# EAGLE schematic LEDs (EAGLE 9.5.2)
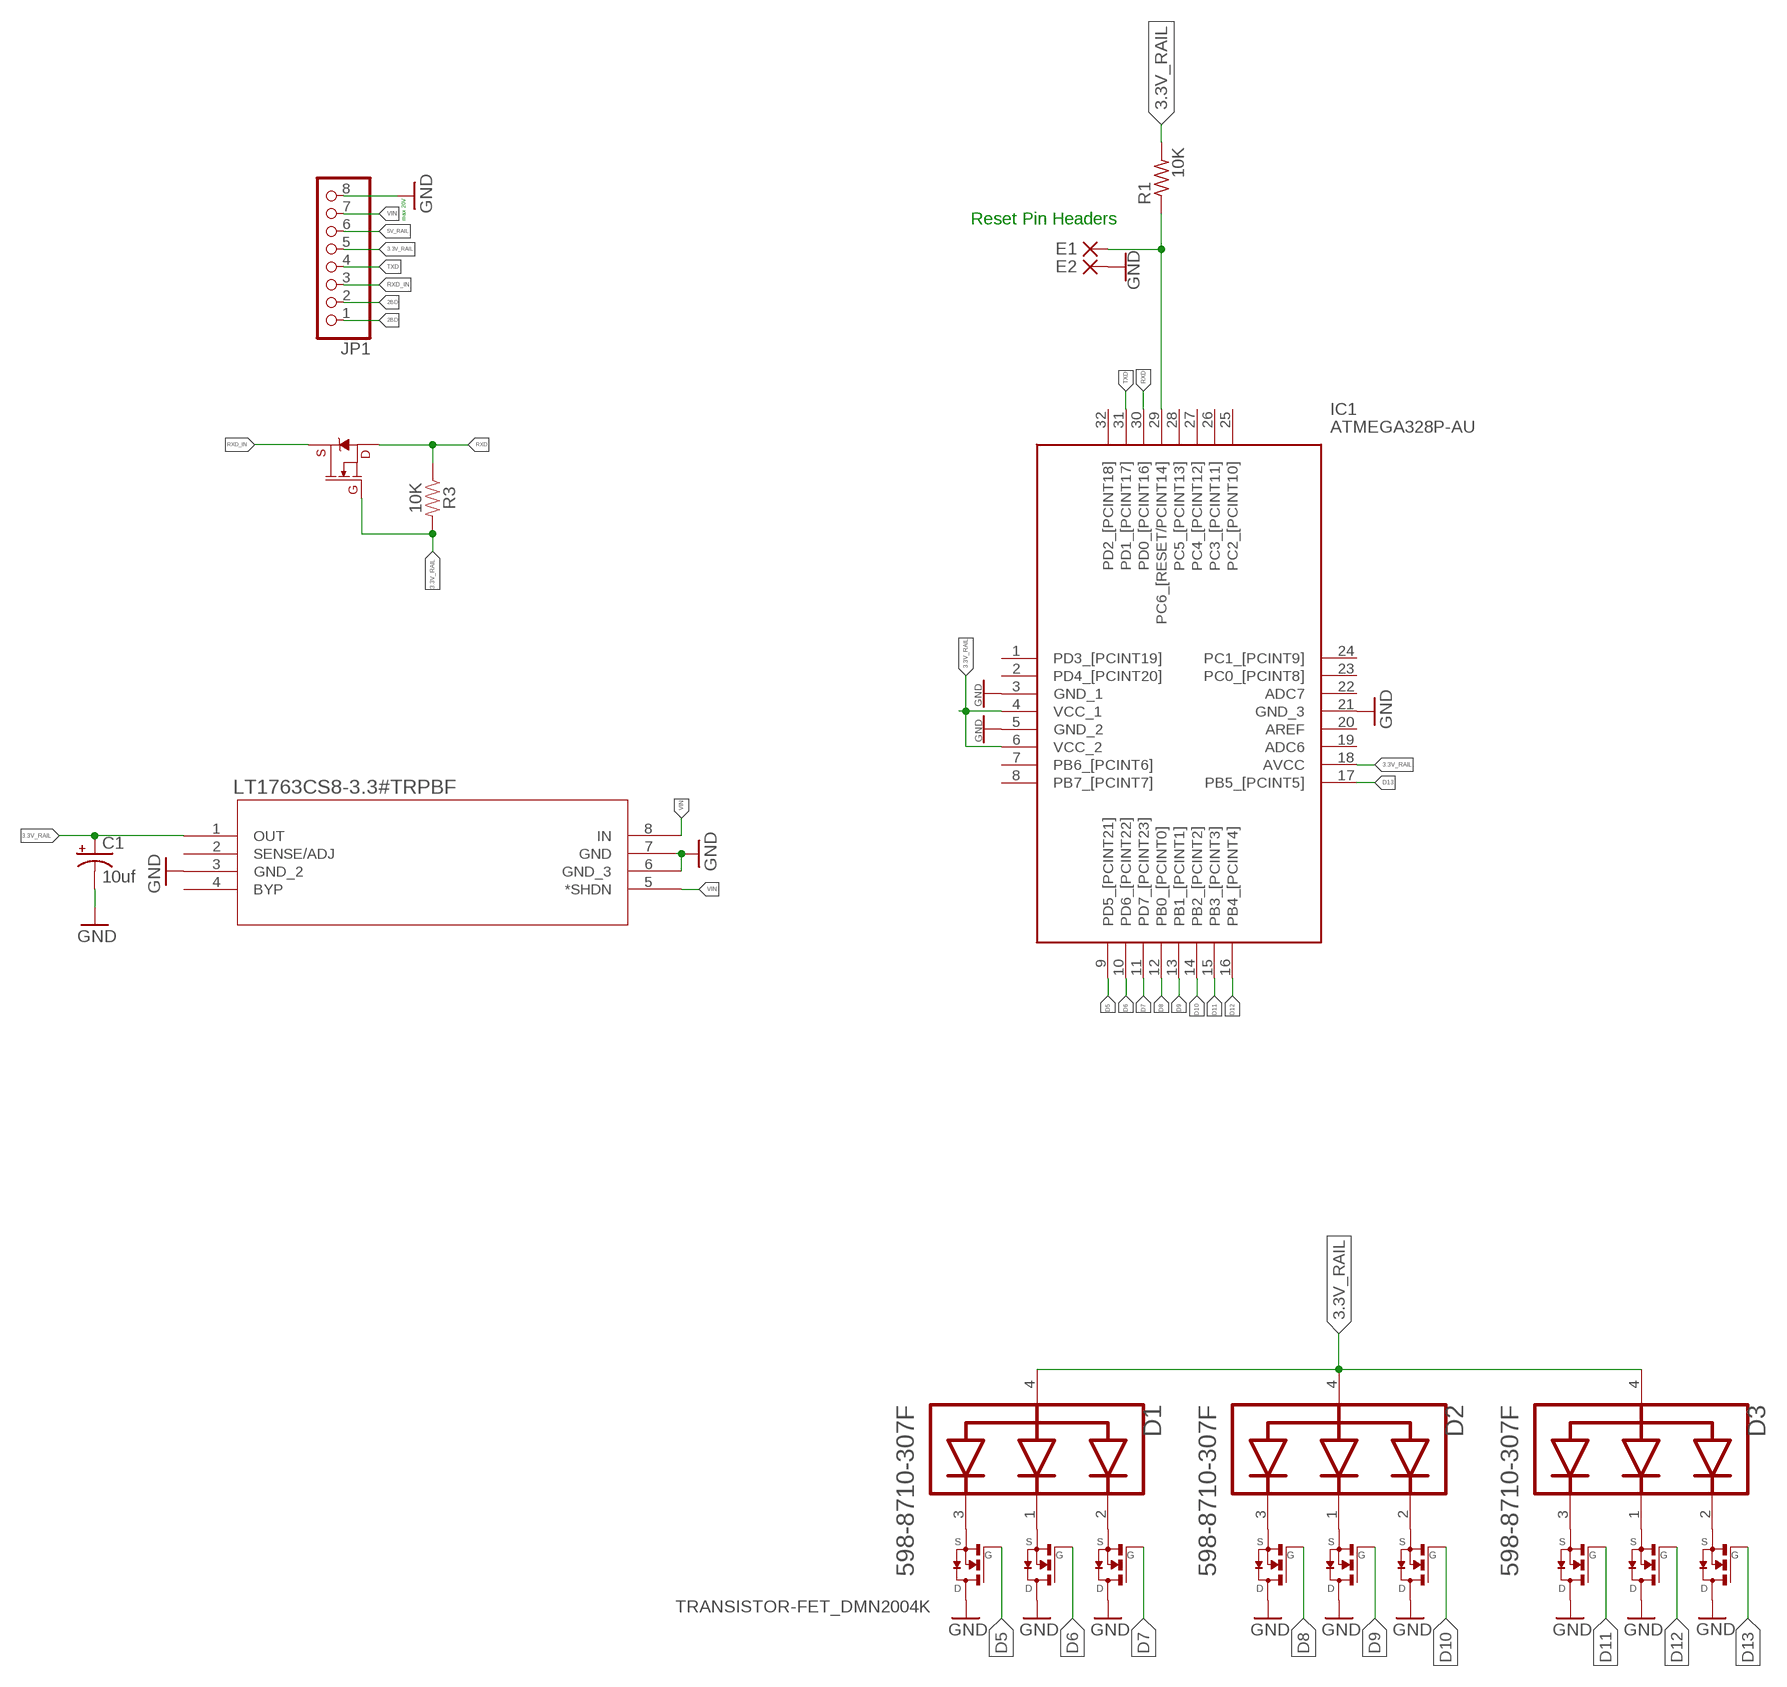
[diagram p0: schematic, sheet 1]

## Parts
C1  10uf  CPOL-USE1.8-4  [E1,8-4]
D1  DIALIGHT_598-8710-307FDIALIGHT_598-8710-307F_0_0  [DIALIGHT_598-8710-307F_0]
D2  DIALIGHT_598-8710-307FDIALIGHT_598-8710-307F_0_0  [DIALIGHT_598-8710-307F_0]
D3  DIALIGHT_598-8710-307FDIALIGHT_598-8710-307F_0_0  [DIALIGHT_598-8710-307F_0]
E1  DPADS_PAD-0400-S  [DPADS_0400-S]
E2  DPADS_PAD-0400-S  [DPADS_0400-S]
IC1  ATMEGA328P-AU  [QFP80P900X900X120-32N]
JP1  PINHD-1X8CLEANBIG  [1X08-CLEANBIG]
Q1  TRANSISTOR-FET_DMN2004K  [TRANSISTOR-FET_SOT23]
Q2  TRANSISTOR-FET_DMN2004K  [TRANSISTOR-FET_SOT23]
Q3  TRANSISTOR-FET_DMN2004K  [TRANSISTOR-FET_SOT23]
Q4  TRANSISTOR-FET_DMN2004K  [TRANSISTOR-FET_SOT23]
Q5  TRANSISTOR-FET_DMN2004K  [TRANSISTOR-FET_SOT23]
Q6  TRANSISTOR-FET_DMN2004K  [TRANSISTOR-FET_SOT23]
Q7  TRANSISTOR-FET_DMN2004K  [TRANSISTOR-FET_SOT23]
Q8  TRANSISTOR-FET_DMN2004K  [TRANSISTOR-FET_SOT23]
Q9  TRANSISTOR-FET_DMN2004K  [TRANSISTOR-FET_SOT23]
Q10  220mA/50V/3.5Ω  MOSFET-NCH-BSS138  [SOT23-3]
R1  10K  R-US_0207/10  [0207/10]
R3  10K  10OHM-HORIZ-1/4W-1%  [AXIAL-0.3]
U1  LT1763CS8-3.3#TRPBF  [SO-8_S]

## Nets
2BD: JP1.1 JP1.2
3.3V_RAIL: C1.+ D1.4(COMMON_ANODE) D2.4(COMMON_ANODE) D3.4(COMMON_ANODE) IC1.4(VCC_1) IC1.6(VCC_2) IC1.18(AVCC) JP1.5 Q10.1(G) R1.2 R3.P$2 U1.1(OUT)
5V_RAIL: JP1.6
D5: IC1.9(PD5_[PCINT21]) Q1.1(G)
D6: IC1.10(PD6_[PCINT22]) Q2.1(G)
D7: IC1.11(PD7_[PCINT23]) Q3.1(G)
D8: IC1.12(PB0_[PCINT0]) Q4.1(G)
D9: IC1.13(PB1_[PCINT1]) Q5.1(G)
D10: IC1.14(PB2_[PCINT2]) Q6.1(G)
D11: IC1.15(PB3_[PCINT3]) Q7.1(G)
D12: IC1.16(PB4_[PCINT4]) Q8.1(G)
D13: IC1.17(PB5_[PCINT5]) Q9.1(G)
GND: C1.- E2.PAD(P) IC1.3(GND_1) IC1.5(GND_2) IC1.21(GND_3) JP1.8 Q1.3(D) Q2.3(D) Q3.3(D) Q4.3(D) Q5.3(D) Q6.3(D) Q7.3(D) Q8.3(D) Q9.3(D) U1.3(GND_2) U1.6(GND_3) U1.7(GND)
N$1: D1.3(BLUE_CATHODE) Q1.2(S)
N$2: D1.1(GREEN_CATHODE) Q2.2(S)
N$3: D1.2(RED_CATHODE) Q3.2(S)
N$4: D2.3(BLUE_CATHODE) Q4.2(S)
N$5: D2.1(GREEN_CATHODE) Q5.2(S)
N$6: D2.2(RED_CATHODE) Q6.2(S)
N$7: D3.3(BLUE_CATHODE) Q7.2(S)
N$8: D3.1(GREEN_CATHODE) Q8.2(S)
N$9: D3.2(RED_CATHODE) Q9.2(S)
N$15: E1.PAD(P) IC1.29(PC6_[RESET/PCINT14]) R1.1
RXD: IC1.30(PD0_[PCINT16]) Q10.2(S) R3.P$1
RXD_IN: JP1.3 Q10.3(D)
TXD: IC1.31(PD1_[PCINT17]) JP1.4
VIN: JP1.7 U1.5(*SHDN) U1.8(IN)
Unconnected: IC1.1(PD3_[PCINT19]) IC1.2(PD4_[PCINT20]) IC1.7(PB6_[PCINT6]) IC1.8(PB7_[PCINT7]) IC1.19(ADC6) IC1.20(AREF) IC1.22(ADC7) IC1.23(PC0_[PCINT8]) IC1.24(PC1_[PCINT9]) IC1.25(PC2_[PCINT10]) IC1.26(PC3_[PCINT11]) IC1.27(PC4_[PCINT12]) IC1.28(PC5_[PCINT13]) IC1.32(PD2_[PCINT18]) U1.2(SENSE/ADJ) U1.4(BYP)

## Notes on the sheet
- max 20V
- Reset Pin Headers

## Library data of the parts
C1 = adafruit:CPOL-US: POLARIZED CAPACITOR, American symbol; SPICEPREFIX: C
D1-D3 = Dialight - 598-8710-307F:DIALIGHT_598-8710-307F: Micro LED; CENTROID_NOT_SPECIFIED: No; DATASHEET: https://media.digikey.com/pdf/Data%20Sheets/Dialight%20PDFs/598_Series_0606_Pkg.pdf; DIGIKEY_DESCRIPTION: DIODE LED RGB CLEAR 0606 SMD; DIGIKEY_PART_NUMBER: 350-2096-1-ND; LEAD_FREE: yes; MF: Dialight; MOUSER_PART_NUMBER: 645-598-8710-307F; MPN: 598-8710-307F; PACKAGE: LED_SMD; PREFIX: D; ROHS: yes; SPICEPREFIX: E; TEMPERATURE_RANGE_HIGH: +100°C; TEMPERATURE_RANGE_LOW: -40°C
E1 E2 = 52101-101-REV-A:DPADS_PAD: WIRE PAD Standard US Drill Sizes and SMD pads; BOM: EXCLUDE
IC1 = ATMEGA328P-AU:ATMEGA328P-AU: MICROCHIP - ATMEGA328P-AU. - MICROCONTROLLER MCU, 8 BIT, ATMEGA, 20MHZ, TQFP-32 Source: Datasheet <https://componentsearchengine.com/Datasheets/2/ATMEGA328P-AU.pdf>; DESCRIPTION: MICROCHIP - ATMEGA328P-AU. - MICROCONTROLLER MCU, 8 BIT, ATMEGA, 20MHZ, TQFP-32; HEIGHT: 1.2mm; MANUFACTURER_NAME: Microchip; MANUFACTURER_PART_NUMBER: ATMEGA328P-AU; MOUSER_PART_NUMBER: 556-ATMEGA328P-AU; MOUSER_PRICE-STOCK: https://www.mouser.com/Search/Refine.aspx?Keyword=556-ATMEGA328P-AU; RS_PART_NUMBER: 1310271P; RS_PRICE-STOCK: http://uk.rs-online.com/web/p/products/1310271P; SPICEPREFIX: X
JP1 = adafruit:PINHD-1X8: PIN HEADER
Q1-Q9 = 52101-101-REV-A:TRANSISTOR-FET_DMN2004K: N-Channel Enhancement MOSFET; SPICEPREFIX: Q
Q10 = SparkFun-DiscreteSemi:MOSFET-NCH: N-channel MOSFETs Voltage controlled devices that allow control of high current outputs. SparkFun Products: SparkFun OpenScale <https://www.sparkfun.com/products/13261> SparkFun Digital Sandbox <https://www.sparkfun.com/products/12651> SparkFun Monster Moto Shield <https://www.sparkfun.com/products/10182> SparkFun MOSFET Power Controller <https://www.sparkfun.com/products/11214>; PROD_ID: TRANS-00830
R1 = adafruit:R-US_: RESISTOR, American symbol
R3 = SparkFun-Resistors:10OHM: 10Ω resistor A resistor is a passive two-terminal electrical component that implements electrical resistance as a circuit element. Resistors act to reduce current flow, and, at the same time, act to lower voltage levels within circuits. - Wikipedia; PROD_ID: RES-12180; VALUE: 10
U1 = LT1763CS8-3.3_TRPBF:LT1763CS8-3.3#TRPBF; DESCRIPTION: LDO Regulator Pos 3.3V 0.5A Automotive 8-Pin SOIC N T/R; DIGI-KEY_PART_NUMBER: LT1763CS8-3.3#TRPBFCT-ND; DIGI-KEY_PURCHASE_URL: https://www.digikey.co.nz/product-detail/en/linear-technology-analog-devices/LT1763CS8-3.3-TRPBF/LT1763CS8-3.3-TRPBFCT-ND/4247566?utm_source=snapeda&utm_medium=aggregator&utm_campaign=symbol; MF: Analog Devices; MP: LT1763CS8-3.3#TRPBF; PACKAGE: SOIC -8 Analog Devices; SPICEPREFIX: X